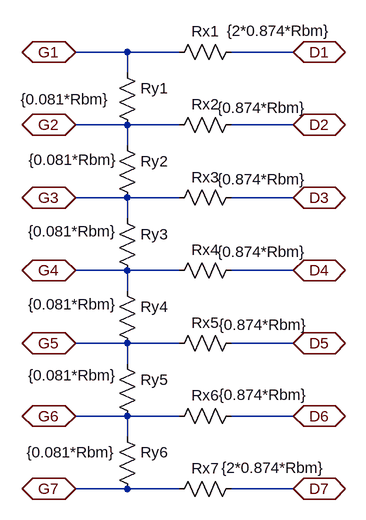
[diagram p0: schematic reseauR.asc]
reseauR.asc, the LTspice schematic file:
Version 4
SHEET 1 880 892
WIRE -16 32 -96 32
WIRE 64 32 -16 32
WIRE 240 32 144 32
WIRE -16 64 -16 32
WIRE -16 144 -96 144
WIRE 64 144 -16 144
WIRE 240 144 144 144
WIRE -16 176 -16 144
WIRE -16 256 -96 256
WIRE 64 256 -16 256
WIRE 240 256 144 256
WIRE -16 288 -16 256
WIRE -16 368 -96 368
WIRE 64 368 -16 368
WIRE 240 368 144 368
WIRE -16 400 -16 368
WIRE -16 480 -96 480
WIRE 64 480 -16 480
WIRE 240 480 144 480
WIRE -16 512 -16 480
WIRE -16 592 -96 592
WIRE 64 592 -16 592
WIRE 240 592 144 592
WIRE -16 624 -16 592
WIRE -16 704 -96 704
WIRE 64 704 -16 704
WIRE 240 704 144 704
FLAG -96 32 G1
IOPIN -96 32 BiDir
FLAG -96 144 G2
IOPIN -96 144 BiDir
FLAG -96 256 G3
IOPIN -96 256 BiDir
FLAG -96 368 G4
IOPIN -96 368 BiDir
FLAG -96 480 G5
IOPIN -96 480 BiDir
FLAG -96 592 G6
IOPIN -96 592 BiDir
FLAG -96 704 G7
IOPIN -96 704 BiDir
FLAG 240 32 D1
IOPIN 240 32 BiDir
FLAG 240 144 D2
IOPIN 240 144 BiDir
FLAG 240 256 D3
IOPIN 240 256 BiDir
FLAG 240 368 D4
IOPIN 240 368 BiDir
FLAG 240 480 D5
IOPIN 240 480 BiDir
FLAG 240 592 D6
IOPIN 240 592 BiDir
FLAG 240 704 D7
IOPIN 240 704 BiDir
SYMBOL res -32 48 R0
WINDOW 3 -11 57 Right 0
SYMATTR Value {0.081*Rbm}
SYMATTR InstName Ry1
SYMBOL res -32 160 R0
WINDOW 3 -136 38 Left 0
SYMATTR Value {0.081*Rbm}
SYMATTR InstName Ry2
SYMBOL res -32 272 R0
WINDOW 3 -137 36 Left 0
SYMATTR Value {0.081*Rbm}
SYMATTR InstName Ry3
SYMBOL res -32 384 R0
WINDOW 3 -137 36 Left 0
SYMATTR Value {0.081*Rbm}
SYMATTR InstName Ry4
SYMBOL res -32 496 R0
WINDOW 3 -137 33 Left 0
SYMATTR Value {0.081*Rbm}
SYMATTR InstName Ry5
SYMBOL res -32 608 R0
WINDOW 3 -139 40 Left 0
SYMATTR Value {0.081*Rbm}
SYMATTR InstName Ry6
SYMBOL res 160 16 R90
WINDOW 0 0 56 VBottom 0
WINDOW 3 -32 -57 VTop 0
SYMATTR InstName Rx1
SYMATTR Value {2*0.874*Rbm}
SYMBOL res 160 128 R90
WINDOW 0 0 56 VBottom 0
WINDOW 3 -26 -31 VTop 0
SYMATTR InstName Rx2
SYMATTR Value {0.874*Rbm}
SYMBOL res 160 240 R90
WINDOW 0 0 56 VBottom 0
WINDOW 3 -28 -31 VTop 0
SYMATTR InstName Rx3
SYMATTR Value {0.874*Rbm}
SYMBOL res 160 352 R90
WINDOW 0 0 56 VBottom 0
WINDOW 3 -28 -31 VTop 0
SYMATTR InstName Rx4
SYMATTR Value {0.874*Rbm}
SYMBOL res 160 464 R90
WINDOW 0 0 56 VBottom 0
WINDOW 3 -28 -34 VTop 0
SYMATTR InstName Rx5
SYMATTR Value {0.874*Rbm}
SYMBOL res 160 576 R90
WINDOW 0 0 56 VBottom 0
WINDOW 3 -32 -34 VTop 0
SYMATTR InstName Rx6
SYMATTR Value {0.874*Rbm}
SYMBOL res 160 688 R90
WINDOW 0 0 56 VBottom 0
WINDOW 3 -32 -49 VTop 0
SYMATTR InstName Rx7
SYMATTR Value {2*0.874*Rbm}

The netlist it stands for:
* reseauR.asc
Ry1 G1 G2 {0.081*Rbm}
Ry2 G2 G3 {0.081*Rbm}
Ry3 G3 G4 {0.081*Rbm}
Ry4 G4 G5 {0.081*Rbm}
Ry5 G5 G6 {0.081*Rbm}
Ry6 G6 G7 {0.081*Rbm}
Rx1 D1 G1 {2*0.874*Rbm}
Rx2 D2 G2 {0.874*Rbm}
Rx3 D3 G3 {0.874*Rbm}
Rx4 D4 G4 {0.874*Rbm}
Rx5 D5 G5 {0.874*Rbm}
Rx6 D6 G6 {0.874*Rbm}
Rx7 D7 G7 {2*0.874*Rbm}
.backanno
.end